# Altium project MiniPC MB GOST.PrjPcb (part 8 of 31)

## Sheet Supply Driver 12V.SchDoc
size 420 x 297 mm; Author: ALTIUM GOSTBOM2.0 KEV; SheetNumber: 43; SheetTotal: 48
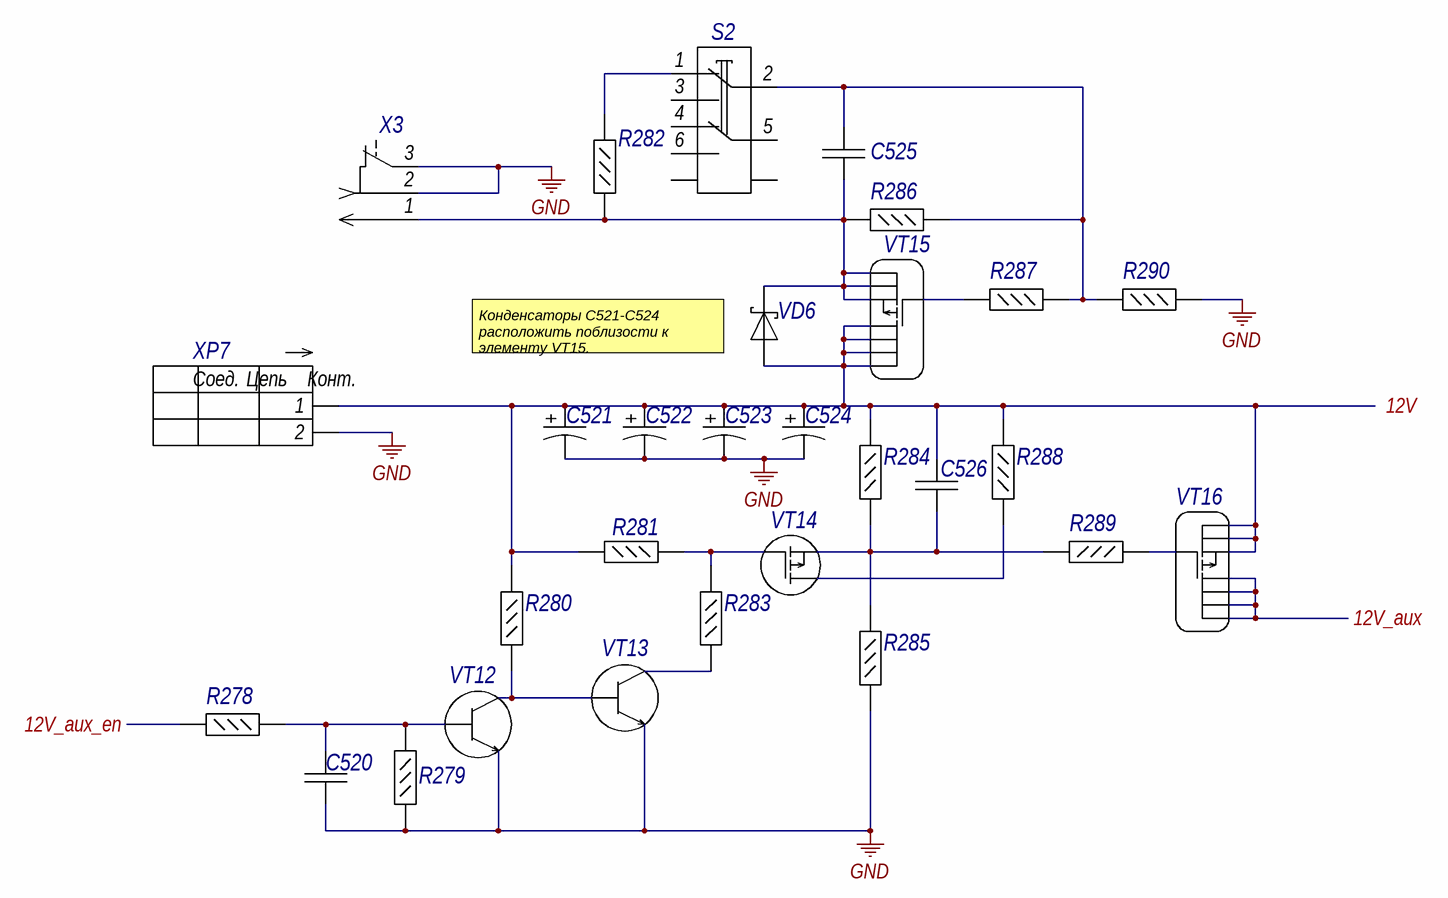
[diagram p10: Supply Driver 12V.SchDoc]

### Parts
C520  C1005X7R1E104M  [CAPC1005X55X10LL05]  (value not drawn)
C521  EEH-ZA1E331P  [PNSC-EEH-ZA1E331P_M]  (value not drawn)
C522  EEH-ZA1E331P  [PNSC-EEH-ZA1E331P_M]  (value not drawn)
C523  EEH-ZA1E331P  [PNSC-EEH-ZA1E331P_M]  (value not drawn)
C524  EEH-ZA1E331P  [PNSC-EEH-ZA1E331P_M]  (value not drawn)
C525  CGB2A1X5R1E105K033BC  [CAPC1005X33X10LL5]  (value not drawn)
C526  CGB2A1X5R1E105K033BC  [CAPC1005X33X10LL5]  (value not drawn)
R278  ERJ-2RKF1001X  [RESC1005X40X25LL05T05]  (value not drawn)
R279  ERJ-2RKF1002X  [RESC1005X40X25LL05T05]  (value not drawn)
R280  ERJ-2RKF4992X  [RESC1005X40X25LL05T05]  (value not drawn)
R281  ERJ-2RKF4992X  [RESC1005X40X25LL05T05]  (value not drawn)
R282  ERJ-2RKF10R0X  [RESC1005X40X25LL05T05]  (value not drawn)
R283  ERJ-2RKF1001X  [RESC1005X40X25LL05T05]  (value not drawn)
R284  ERJ-2RKF4992X  [RESC1005X40X25LL05T05]  (value not drawn)
R285  ERJ-2RKF1003X  [RESC1005X40X25LL05T05]  (value not drawn)
R286  ERJ-2RKF4992X  [RESC1005X40X25LL05T05]  (value not drawn)
R287  ERJ-2RKF10R0X  [RESC1005X40X25LL05T05]  (value not drawn)
R288  ERJ-2RKF10R0X  [RESC1005X40X25LL05T05]  (value not drawn)
R289  ERJ-2RKF10R0X  [RESC1005X40X25LL05T05]  (value not drawn)
R290  ERJ-2RKF1003X  [RESC1005X40X25LL05T05]  (value not drawn)
S2  EG2207  [ESWI-EG2207_V]  (value not drawn)
VD6  B530C-13-F  [DIOD-SMC-2_V]  (value not drawn)
VT12  MMBT2222A-7-F  [DIOD-SOT23-3_V]  (value not drawn)
VT13  MMBT2222A-7-F  [DIOD-SOT23-3_V]  (value not drawn)
VT14  DMP3098L-7  [DIOD-SOT23-3_V]  (value not drawn)
VT15  Si7635DP-T1-GE3  [VISH-PPAKSO-8_V]  (value not drawn)
VT16  Si7635DP-T1-GE3  [VISH-PPAKSO-8_V]  (value not drawn)
X3  16PJ032  [KOBI-16PJ032_V]  (value not drawn)
XP7  613 002 111 21  [WE-61300211121_V]  (value not drawn)

### Ports
12V, 12V_aux, 12V_aux_en

### Nets
GND: C520.1 C521.2 C522.2 C523.2 C524.2 R279.1 R285.1 R290.1 VT12.2 VT13.2 X3.2 X3.3 XP7.2
12V_INPUT: C521.1 C522.1 C523.1 C524.1 C526.2 R280.2 R281.2 R284.2 R288.2 VD6.1(A) VT15.5(D) VT15.6(D) VT15.7(D) VT15.8(D) VT16.1(S) VT16.2(S) VT16.3(S) XP7.1 ; port 12V
aux_12V: VT16.5(D) VT16.6(D) VT16.7(D) VT16.8(D) ; port 12V_aux
NetC520_2: C520.2 R278.2 R279.2 VT12.1
NetC525_1: C525.1 R286.1 R287.1 R290.2 S2.2
NetC525_2: C525.2 R282.2 R286.2 VD6.2(K) VT15.1(S) VT15.2(S) VT15.3(S) X3.1
NetC526_1: C526.1 R284.1 R285.2 R289.1 VT14.2
NetR278_1: R278.1 ; port 12V_aux_en
NetR280_1: R280.1 VT12.3 VT13.1
NetR281_1: R281.1 R283.2 VT14.1
NetR282_1: R282.1 S2.1
NetR283_1: R283.1 VT13.3
NetR287_2: R287.2 VT15.4(G)
NetR288_1: R288.1 VT14.3
NetR289_2: R289.2 VT16.4(G)

Not connected (* = marked no-connect by the designer): S2 3 4 5 6 MH1 MH2

### Notes on the sheet
- (near VD6) Конденсаторы C521-C524 расположить поблизости к элементу VT15.
- Подп. дата
- Инв. № дубл.
- Взам. инв. №
- Подп. и дата
- Инв. № подл.
- Изм.
- Лист
- № докум.
- Подп.
- Дата
- ALTIUM GOSTBOM2.0 KEV
- Файл:
- Копировал
- Формат А3
- (in symbol E12) +
- (in symbol E32) Соед.; Цепь; Конт.

### Library data of the parts
C520 = E11: Chip Capacitor, 0.1 uF, +/- 20%, 25 V, -55 to 125 degC, 0402 (1005 Metric), RoHS, Tape and Reel; Тип элемента: Конденсатор; Capacitance: 100 nF; Case\/Package: 0402; Type (Capacitors): X7R; Voltage Rating: 25 V; Old_des: C79; New_des: C520; UID: E11; Component Kind: Standard; Case Code (Imperial): 0402; Case Code (Metric): 1005; ComponentLink1Description: Manufacturer URL; ComponentLink1URL: http://www.tdk.com/; ComponentLink2Description: Datasheet; ComponentLink2URL: http://www.farnell.com/datasheets/1571323.pdf; DatasheetVersion: 09/2011; Length: 1 mm; Max Operating Temperature: 125 degC; Min Operating Temperature: -55 degC; Mounting Technology: Surface Mount; Package Quantity: 10000; PackageDescription: 2-Pin Surface Mount Device, Body 1 x 0.5 mm; Packaging: Tape and Reel; PartNumber: C1005X7R1E104M; RoHSCompliant: true; Tolerance: 20%; Width: 0.5 mm; Height: 0.5 mm; Mount: Surface Mount; PackageReference: 0402; Pins: 2; Voltage Rating (DC): 25 V
C521 = E12: Aluminum Electrolytic Capacitor, 330 uF, +/- 20%, 25 V, -55 to 105 degC, 2-Pin CAPAE, RoHS, Tape and Reel; Тип элемента: Конденсатор; Capacitance: 330 uF; Case\/Package: G; Voltage Rating: 25 V; Old_des: C74; New_des: C521; UID: E12; Component Kind: Standard; ComponentLink1Description: Manufacturer URL; ComponentLink1URL: http://www.panasonic.com/; ComponentLink2Description: Datasheet; ComponentLink2URL: https://datasheet.ciiva.com/25613/0900766b81233638-25613835.pdf; DatasheetVersion: 10/2014; Length: 10.2 mm; Max Operating Temperature: 105 degC; Min Operating Temperature: -55 degC; Mounting Technology: Surface Mount; Package Quantity: 500; PackageDescription: 2-Pin Aluminum Electrolytic Capacitor, Body 10.2 x 10.2 mm, Diameter 10 mm; Packaging: Tape and Reel; RoHSCompliant: true; Tolerance: 20%; Height: 10.5 mm; Mount: Surface Mount; PackageReference: EEH-ZA1E331P; Radiation Hardening: No; REACH SVHC: Unknown; Voltage Rating (DC): 25 V
C522 = E12: Aluminum Electrolytic Capacitor, 330 uF, +/- 20%, 25 V, -55 to 105 degC, 2-Pin CAPAE, RoHS, Tape and Reel; Тип элемента: Конденсатор; Capacitance: 330 uF; Case\/Package: G; Voltage Rating: 25 V; Old_des: C75; New_des: C522; UID: E12; Component Kind: Standard; ComponentLink1Description: Manufacturer URL; ComponentLink1URL: http://www.panasonic.com/; ComponentLink2Description: Datasheet; ComponentLink2URL: https://datasheet.ciiva.com/25613/0900766b81233638-25613835.pdf; DatasheetVersion: 10/2014; Length: 10.2 mm; Max Operating Temperature: 105 degC; Min Operating Temperature: -55 degC; Mounting Technology: Surface Mount; Package Quantity: 500; PackageDescription: 2-Pin Aluminum Electrolytic Capacitor, Body 10.2 x 10.2 mm, Diameter 10 mm; Packaging: Tape and Reel; RoHSCompliant: true; Tolerance: 20%; Height: 10.5 mm; Mount: Surface Mount; PackageReference: EEH-ZA1E331P; Radiation Hardening: No; REACH SVHC: Unknown; Voltage Rating (DC): 25 V
C523 = E12: Aluminum Electrolytic Capacitor, 330 uF, +/- 20%, 25 V, -55 to 105 degC, 2-Pin CAPAE, RoHS, Tape and Reel; Тип элемента: Конденсатор; Capacitance: 330 uF; Case\/Package: G; Voltage Rating: 25 V; Old_des: C76; New_des: C523; UID: E12; Component Kind: Standard; ComponentLink1Description: Manufacturer URL; ComponentLink1URL: http://www.panasonic.com/; ComponentLink2Description: Datasheet; ComponentLink2URL: https://datasheet.ciiva.com/25613/0900766b81233638-25613835.pdf; DatasheetVersion: 10/2014; Length: 10.2 mm; Max Operating Temperature: 105 degC; Min Operating Temperature: -55 degC; Mounting Technology: Surface Mount; Package Quantity: 500; PackageDescription: 2-Pin Aluminum Electrolytic Capacitor, Body 10.2 x 10.2 mm, Diameter 10 mm; Packaging: Tape and Reel; RoHSCompliant: true; Tolerance: 20%; Height: 10.5 mm; Mount: Surface Mount; PackageReference: EEH-ZA1E331P; Radiation Hardening: No; REACH SVHC: Unknown; Voltage Rating (DC): 25 V
C524 = E12: Aluminum Electrolytic Capacitor, 330 uF, +/- 20%, 25 V, -55 to 105 degC, 2-Pin CAPAE, RoHS, Tape and Reel; Тип элемента: Конденсатор; Capacitance: 330 uF; Case\/Package: G; Voltage Rating: 25 V; Old_des: C77; New_des: C524; UID: E12; Component Kind: Standard; ComponentLink1Description: Manufacturer URL; ComponentLink1URL: http://www.panasonic.com/; ComponentLink2Description: Datasheet; ComponentLink2URL: https://datasheet.ciiva.com/25613/0900766b81233638-25613835.pdf; DatasheetVersion: 10/2014; Length: 10.2 mm; Max Operating Temperature: 105 degC; Min Operating Temperature: -55 degC; Mounting Technology: Surface Mount; Package Quantity: 500; PackageDescription: 2-Pin Aluminum Electrolytic Capacitor, Body 10.2 x 10.2 mm, Diameter 10 mm; Packaging: Tape and Reel; RoHSCompliant: true; Tolerance: 20%; Height: 10.5 mm; Mount: Surface Mount; PackageReference: EEH-ZA1E331P; Radiation Hardening: No; REACH SVHC: Unknown; Voltage Rating (DC): 25 V
C525 = E2: Chip Capacitor, 1 uF, +/- 10%, 25 V, -55 to 85 degC, 0402 (1005 Metric), RoHS, Tape and Reel; Тип элемента: Конденсатор; Capacitance: 1 uF; Old_des: C73; New_des: C525; UID: E2; Component Kind: Standard; Case Code (Imperial): 0402; Case Code (Metric): 1005; Case/Package: 0402; ComponentLink1Description: Manufacturer URL; ComponentLink1URL: http://www.tdk.com/; ComponentLink2Description: Datasheet; ComponentLink2URL: https://product.tdk.com/info/en/catalog/datasheets/mlcc_commercial_lowprofile_en.pdf; DatasheetVersion: 04/2015; Length: 0.039 inch; Max Operating Temperature: 85 degC; Min Operating Temperature: -55 degC; Mounting Technology: Surface Mount; Package Quantity: 1; PackageDescription: 2-Pin Surface Mount Device, Body 1 x 0.5 mm; Packaging: Tape and Reel; PartNumber: CGB2A1X5R1E105K033BC; RoHSCompliant: True; Tolerance: 10%; Width: 0.02 inch
C526 = E2: Chip Capacitor, 1 uF, +/- 10%, 25 V, -55 to 85 degC, 0402 (1005 Metric), RoHS, Tape and Reel; Тип элемента: Конденсатор; Capacitance: 1 uF; Old_des: C78; New_des: C526; UID: E2; Component Kind: Standard; Case Code (Imperial): 0402; Case Code (Metric): 1005; Case/Package: 0402; ComponentLink1Description: Manufacturer URL; ComponentLink1URL: http://www.tdk.com/; ComponentLink2Description: Datasheet; ComponentLink2URL: https://product.tdk.com/info/en/catalog/datasheets/mlcc_commercial_lowprofile_en.pdf; DatasheetVersion: 04/2015; Length: 0.039 inch; Max Operating Temperature: 85 degC; Min Operating Temperature: -55 degC; Mounting Technology: Surface Mount; Package Quantity: 1; PackageDescription: 2-Pin Surface Mount Device, Body 1 x 0.5 mm; Packaging: Tape and Reel; PartNumber: CGB2A1X5R1E105K033BC; RoHSCompliant: True; Tolerance: 10%; Width: 0.02 inch
R278 = E59: Chip Resistor, 1 KOhm, +/- 1%, 100 mW, -55 to 155 degC, 0402 (1005 Metric), RoHS, Tape and Reel; Manufacturer: Basic Passives; Тип элемента: Резистор; Case\/Package: 0402; Voltage Rating: 50 V; Power Rating: 100 mW; Resistance: 1 KOhm; Old_des: R139; New_des: R278; UID: E59; Component Kind: Standard; Case Code (Imperial): 0402; Case Code (Metric): 1005; ComponentLink1Description: Manufacturer URL; ComponentLink1URL: http://www.panasonic.com/; ComponentLink2Description: Datasheet; ComponentLink2URL: http://industrial.panasonic.com/cdbs/www-data/pdf/RDA0000/AOA0000C86.pdf; DatasheetVersion: 04/2015; Length: 1 mm; Max Operating Temperature: 155 degC; Min Operating Temperature: -55 degC; Mounting Technology: Surface Mount; Package Quantity: 10000; PackageDescription: 2-Pin Surface Mount Device, Body 1 x 0.5 mm; Packaging: Tape and Reel; PartNumber: ERJ-2RKF1001X; RoHSCompliant: true; Tolerance: 1%; Width: 0.5 mm; Height: 0.35 mm; Mount: Surface Mount; PackageReference: 0402; Pins: 2; Radiation Hardening: No; REACH SVHC: Yes
R279 = E60: Chip Resistor, 10 KOhm, +/- 1%, 100 mW, -55 to 155 degC, 0402 (1005 Metric), RoHS, Tape and Reel; Manufacturer: Basic Passives; Тип элемента: Резистор; Case\/Package: 0402; Voltage Rating: 50 V; Power Rating: 100 mW; Resistance: 10 KOhm; Old_des: R140; New_des: R279; UID: E60; Component Kind: Standard; Case Code (Imperial): 0402; Case Code (Metric): 1005; ComponentLink1Description: Manufacturer URL; ComponentLink1URL: http://www.panasonic.com/; ComponentLink2Description: Datasheet; ComponentLink2URL: http://industrial.panasonic.com/cdbs/www-data/pdf/RDA0000/AOA0000C86.pdf; DatasheetVersion: 04/2015; Length: 1 mm; Max Operating Temperature: 155 degC; Min Operating Temperature: -55 degC; Mounting Technology: Surface Mount; Package Quantity: 10000; PackageDescription: 2-Pin Surface Mount Device, Body 1 x 0.5 mm; Packaging: Tape and Reel; PartNumber: ERJ-2RKF1002X; RoHSCompliant: true; Tolerance: 1%; Width: 0.5 mm; Height: 0.35 mm; Mount: Surface Mount; PackageReference: 0402; Pins: 2; Radiation Hardening: No; REACH SVHC: Yes
R280 = E57: Chip Resistor, 49.9 KOhm, +/- 1%, 100 mW, -55 to 155 degC, 0402 (1005 Metric), RoHS, Tape and Reel; Manufacturer: Basic Passives; Тип элемента: Резистор; Case\/Package: 0402; Voltage Rating: 50 V; Power Rating: 100 mW; Old_des: R133; New_des: R280; UID: E57; Component Kind: Standard; Case Code (Imperial): 0402; Case Code (Metric): 1005; ComponentLink1Description: Manufacturer URL; ComponentLink1URL: http://www.panasonic.com/; ComponentLink2Description: Datasheet; ComponentLink2URL: http://industrial.panasonic.com/cdbs/www-data/pdf/RDA0000/AOA0000C86.pdf; DatasheetVersion: 04/2015; Length: 1 mm; Max Operating Temperature: 155 degC; Min Operating Temperature: -55 degC; Mounting Technology: Surface Mount; Package Quantity: 10000; PackageDescription: 2-Pin Surface Mount Device, Body 1 x 0.5 mm; Packaging: Tape and Reel; PartNumber: ERJ-2RKF4992X; RoHSCompliant: true; Tolerance: 1%; Width: 0.5 mm; Height: 0.35 mm; Mount: Surface Mount; PackageReference: 0402; Pins: 2; Radiation Hardening: No; REACH SVHC: No SVHC; Resistance: 49.9 KOhm
R281 = E57: Chip Resistor, 49.9 KOhm, +/- 1%, 100 mW, -55 to 155 degC, 0402 (1005 Metric), RoHS, Tape and Reel; Manufacturer: Basic Passives; Тип элемента: Резистор; Case\/Package: 0402; Voltage Rating: 50 V; Power Rating: 100 mW; Old_des: R134; New_des: R281; UID: E57; Component Kind: Standard; Case Code (Imperial): 0402; Case Code (Metric): 1005; ComponentLink1Description: Manufacturer URL; ComponentLink1URL: http://www.panasonic.com/; ComponentLink2Description: Datasheet; ComponentLink2URL: http://industrial.panasonic.com/cdbs/www-data/pdf/RDA0000/AOA0000C86.pdf; DatasheetVersion: 04/2015; Length: 1 mm; Max Operating Temperature: 155 degC; Min Operating Temperature: -55 degC; Mounting Technology: Surface Mount; Package Quantity: 10000; PackageDescription: 2-Pin Surface Mount Device, Body 1 x 0.5 mm; Packaging: Tape and Reel; PartNumber: ERJ-2RKF4992X; RoHSCompliant: true; Tolerance: 1%; Width: 0.5 mm; Height: 0.35 mm; Mount: Surface Mount; PackageReference: 0402; Pins: 2; Radiation Hardening: No; REACH SVHC: No SVHC; Resistance: 49.9 KOhm
R282 = E56: Chip Resistor, 10 Ohm, +/- 1%, 100 mW, -55 to 155 degC, 0402 (1005 Metric), RoHS, Tape and Reel; Manufacturer: Basic Passives; Тип элемента: Резистор; Case\/Package: 0402; Voltage Rating: 50 V; Power Rating: 100 mW; Resistance: 10 Ohm; Old_des: R128; New_des: R282; UID: E56; Component Kind: Standard; Case Code (Imperial): 0402; Case Code (Metric): 1005; ComponentLink1Description: Manufacturer URL; ComponentLink1URL: http://www.panasonic.com/; ComponentLink2Description: Datasheet; ComponentLink2URL: http://industrial.panasonic.com/cdbs/www-data/pdf/RDA0000/AOA0000C86.pdf; DatasheetVersion: 04/2015; Length: 1 mm; Max Operating Temperature: 155 degC; Min Operating Temperature: -55 degC; Mounting Technology: Surface Mount; Package Quantity: 10000; PackageDescription: 2-Pin Surface Mount Device, Body 1 x 0.5 mm; Packaging: Tape and Reel; PartNumber: ERJ-2RKF10R0X; RoHSCompliant: true; Tolerance: 1%; Width: 0.5 mm; Height: 0.35 mm; Mount: Surface Mount; PackageReference: 0402; Pins: 2; Radiation Hardening: No; REACH SVHC: Yes
R283 = E59: Chip Resistor, 1 KOhm, +/- 1%, 100 mW, -55 to 155 degC, 0402 (1005 Metric), RoHS, Tape and Reel; Manufacturer: Basic Passives; Тип элемента: Резистор; Case\/Package: 0402; Voltage Rating: 50 V; Power Rating: 100 mW; Resistance: 1 KOhm; Old_des: R138; New_des: R283; UID: E59; Component Kind: Standard; Case Code (Imperial): 0402; Case Code (Metric): 1005; ComponentLink1Description: Manufacturer URL; ComponentLink1URL: http://www.panasonic.com/; ComponentLink2Description: Datasheet; ComponentLink2URL: http://industrial.panasonic.com/cdbs/www-data/pdf/RDA0000/AOA0000C86.pdf; DatasheetVersion: 04/2015; Length: 1 mm; Max Operating Temperature: 155 degC; Min Operating Temperature: -55 degC; Mounting Technology: Surface Mount; Package Quantity: 10000; PackageDescription: 2-Pin Surface Mount Device, Body 1 x 0.5 mm; Packaging: Tape and Reel; PartNumber: ERJ-2RKF1001X; RoHSCompliant: true; Tolerance: 1%; Width: 0.5 mm; Height: 0.35 mm; Mount: Surface Mount; PackageReference: 0402; Pins: 2; Radiation Hardening: No; REACH SVHC: Yes
R284 = E57: Chip Resistor, 49.9 KOhm, +/- 1%, 100 mW, -55 to 155 degC, 0402 (1005 Metric), RoHS, Tape and Reel; Manufacturer: Basic Passives; Тип элемента: Резистор; Case\/Package: 0402; Voltage Rating: 50 V; Power Rating: 100 mW; Old_des: R132; New_des: R284; UID: E57; Component Kind: Standard; Case Code (Imperial): 0402; Case Code (Metric): 1005; ComponentLink1Description: Manufacturer URL; ComponentLink1URL: http://www.panasonic.com/; ComponentLink2Description: Datasheet; ComponentLink2URL: http://industrial.panasonic.com/cdbs/www-data/pdf/RDA0000/AOA0000C86.pdf; DatasheetVersion: 04/2015; Length: 1 mm; Max Operating Temperature: 155 degC; Min Operating Temperature: -55 degC; Mounting Technology: Surface Mount; Package Quantity: 10000; PackageDescription: 2-Pin Surface Mount Device, Body 1 x 0.5 mm; Packaging: Tape and Reel; PartNumber: ERJ-2RKF4992X; RoHSCompliant: true; Tolerance: 1%; Width: 0.5 mm; Height: 0.35 mm; Mount: Surface Mount; PackageReference: 0402; Pins: 2; Radiation Hardening: No; REACH SVHC: No SVHC; Resistance: 49.9 KOhm
R285 = E58: Chip Resistor, 100 KOhm, +/- 1%, 100 mW, -55 to 155 degC, 0402 (1005 Metric), RoHS, Tape and Reel; Manufacturer: Basic Passives; Тип элемента: Резистор; Case\/Package: 0402; Voltage Rating: 50 V; Power Rating: 100 mW; Old_des: R137; New_des: R285; UID: E58; Component Kind: Standard; Case Code (Imperial): 0402; Case Code (Metric): 1005; ComponentLink1Description: Manufacturer URL; ComponentLink1URL: http://www.panasonic.com/; ComponentLink2Description: Datasheet; ComponentLink2URL: http://industrial.panasonic.com/cdbs/www-data/pdf/RDA0000/AOA0000C86.pdf; DatasheetVersion: 04/2015; Length: 1 mm; Max Operating Temperature: 155 degC; Min Operating Temperature: -55 degC; Mounting Technology: Surface Mount; Package Quantity: 10000; PackageDescription: 2-Pin Surface Mount Device, Body 1 x 0.5 mm; Packaging: Tape and Reel; PartNumber: ERJ-2RKF1003X; RoHSCompliant: true; Tolerance: 1%; Width: 0.5 mm; Height: 0.35 mm; Mount: Surface Mount; PackageReference: 0402; Pins: 2; Radiation Hardening: No; REACH SVHC: Yes; Resistance: 100 KOhm
R286 = E57: Chip Resistor, 49.9 KOhm, +/- 1%, 100 mW, -55 to 155 degC, 0402 (1005 Metric), RoHS, Tape and Reel; Manufacturer: Basic Passives; Тип элемента: Резистор; Case\/Package: 0402; Voltage Rating: 50 V; Power Rating: 100 mW; Old_des: R129; New_des: R286; UID: E57; Component Kind: Standard; Case Code (Imperial): 0402; Case Code (Metric): 1005; ComponentLink1Description: Manufacturer URL; ComponentLink1URL: http://www.panasonic.com/; ComponentLink2Description: Datasheet; ComponentLink2URL: http://industrial.panasonic.com/cdbs/www-data/pdf/RDA0000/AOA0000C86.pdf; DatasheetVersion: 04/2015; Length: 1 mm; Max Operating Temperature: 155 degC; Min Operating Temperature: -55 degC; Mounting Technology: Surface Mount; Package Quantity: 10000; PackageDescription: 2-Pin Surface Mount Device, Body 1 x 0.5 mm; Packaging: Tape and Reel; PartNumber: ERJ-2RKF4992X; RoHSCompliant: true; Tolerance: 1%; Width: 0.5 mm; Height: 0.35 mm; Mount: Surface Mount; PackageReference: 0402; Pins: 2; Radiation Hardening: No; REACH SVHC: No SVHC; Resistance: 49.9 KOhm
R287 = E56: Chip Resistor, 10 Ohm, +/- 1%, 100 mW, -55 to 155 degC, 0402 (1005 Metric), RoHS, Tape and Reel; Manufacturer: Basic Passives; Тип элемента: Резистор; Case\/Package: 0402; Voltage Rating: 50 V; Power Rating: 100 mW; Resistance: 10 Ohm; Old_des: R130; New_des: R287; UID: E56; Component Kind: Standard; Case Code (Imperial): 0402; Case Code (Metric): 1005; ComponentLink1Description: Manufacturer URL; ComponentLink1URL: http://www.panasonic.com/; ComponentLink2Description: Datasheet; ComponentLink2URL: http://industrial.panasonic.com/cdbs/www-data/pdf/RDA0000/AOA0000C86.pdf; DatasheetVersion: 04/2015; Length: 1 mm; Max Operating Temperature: 155 degC; Min Operating Temperature: -55 degC; Mounting Technology: Surface Mount; Package Quantity: 10000; PackageDescription: 2-Pin Surface Mount Device, Body 1 x 0.5 mm; Packaging: Tape and Reel; PartNumber: ERJ-2RKF10R0X; RoHSCompliant: true; Tolerance: 1%; Width: 0.5 mm; Height: 0.35 mm; Mount: Surface Mount; PackageReference: 0402; Pins: 2; Radiation Hardening: No; REACH SVHC: Yes
R288 = E56: Chip Resistor, 10 Ohm, +/- 1%, 100 mW, -55 to 155 degC, 0402 (1005 Metric), RoHS, Tape and Reel; Manufacturer: Basic Passives; Тип элемента: Резистор; Case\/Package: 0402; Voltage Rating: 50 V; Power Rating: 100 mW; Resistance: 10 Ohm; Old_des: R135; New_des: R288; UID: E56; Component Kind: Standard; Case Code (Imperial): 0402; Case Code (Metric): 1005; ComponentLink1Description: Manufacturer URL; ComponentLink1URL: http://www.panasonic.com/; ComponentLink2Description: Datasheet; ComponentLink2URL: http://industrial.panasonic.com/cdbs/www-data/pdf/RDA0000/AOA0000C86.pdf; DatasheetVersion: 04/2015; Length: 1 mm; Max Operating Temperature: 155 degC; Min Operating Temperature: -55 degC; Mounting Technology: Surface Mount; Package Quantity: 10000; PackageDescription: 2-Pin Surface Mount Device, Body 1 x 0.5 mm; Packaging: Tape and Reel; PartNumber: ERJ-2RKF10R0X; RoHSCompliant: true; Tolerance: 1%; Width: 0.5 mm; Height: 0.35 mm; Mount: Surface Mount; PackageReference: 0402; Pins: 2; Radiation Hardening: No; REACH SVHC: Yes
R289 = E56: Chip Resistor, 10 Ohm, +/- 1%, 100 mW, -55 to 155 degC, 0402 (1005 Metric), RoHS, Tape and Reel; Manufacturer: Basic Passives; Тип элемента: Резистор; Case\/Package: 0402; Voltage Rating: 50 V; Power Rating: 100 mW; Resistance: 10 Ohm; Old_des: R136; New_des: R289; UID: E56; Component Kind: Standard; Case Code (Imperial): 0402; Case Code (Metric): 1005; ComponentLink1Description: Manufacturer URL; ComponentLink1URL: http://www.panasonic.com/; ComponentLink2Description: Datasheet; ComponentLink2URL: http://industrial.panasonic.com/cdbs/www-data/pdf/RDA0000/AOA0000C86.pdf; DatasheetVersion: 04/2015; Length: 1 mm; Max Operating Temperature: 155 degC; Min Operating Temperature: -55 degC; Mounting Technology: Surface Mount; Package Quantity: 10000; PackageDescription: 2-Pin Surface Mount Device, Body 1 x 0.5 mm; Packaging: Tape and Reel; PartNumber: ERJ-2RKF10R0X; RoHSCompliant: true; Tolerance: 1%; Width: 0.5 mm; Height: 0.35 mm; Mount: Surface Mount; PackageReference: 0402; Pins: 2; Radiation Hardening: No; REACH SVHC: Yes
R290 = E58: Chip Resistor, 100 KOhm, +/- 1%, 100 mW, -55 to 155 degC, 0402 (1005 Metric), RoHS, Tape and Reel; Manufacturer: Basic Passives; Тип элемента: Резистор; Case\/Package: 0402; Voltage Rating: 50 V; Power Rating: 100 mW; Old_des: R131; New_des: R290; UID: E58; Component Kind: Standard; Case Code (Imperial): 0402; Case Code (Metric): 1005; ComponentLink1Description: Manufacturer URL; ComponentLink1URL: http://www.panasonic.com/; ComponentLink2Description: Datasheet; ComponentLink2URL: http://industrial.panasonic.com/cdbs/www-data/pdf/RDA0000/AOA0000C86.pdf; DatasheetVersion: 04/2015; Length: 1 mm; Max Operating Temperature: 155 degC; Min Operating Temperature: -55 degC; Mounting Technology: Surface Mount; Package Quantity: 10000; PackageDescription: 2-Pin Surface Mount Device, Body 1 x 0.5 mm; Packaging: Tape and Reel; PartNumber: ERJ-2RKF1003X; RoHSCompliant: true; Tolerance: 1%; Width: 0.5 mm; Height: 0.35 mm; Mount: Surface Mount; PackageReference: 0402; Pins: 2; Radiation Hardening: No; REACH SVHC: Yes; Resistance: 100 KOhm
S2 = E103: Slide Switch DPDT, 30 V, -20 to 70 degC, 6-Pin THD, RoHS, Bulk; Тип элемента: Набор 2 ключа; Old_des: SW1; New_des: S2; UID: E103; Component Kind: Standard; ComponentLink1Description: Manufacturer URL; ComponentLink1URL: http://www.e-switch.ch/en/; ComponentLink2Description: Datasheet; ComponentLink2URL: https://datasheet.ciiva.com/16174/p040100-16174286.pdf; DatasheetVersion: Rev. E; Length: 10 mm; Max Operating Temperature: 70 degC; Min Operating Temperature: -20 degC; Mounting Technology: Through Hole; Package Quantity: 1000; PackageDescription: 6-Pin Throung Hole Device, Body 10 x 6 mm, Pitch 2 mm; Packaging: Bulk; PartNumber: EG2207; RoHSCompliant: True; Width: 6 mm; Height: 7.7 mm; Mount: Through Hole; REACH SVHC: No SVHC
VD6 = E28: Surface Mount Schottky Barrier Rectifier, 5 A, 0.55 V, -55 to 150 degC, 2-Pin SMD, RoHS, Tape and Reel; Manufacturer: Diodes Inc; Тип элемента: Диод Шоттки; Old_des: D1; New_des: VD6; UID: E28; Component Kind: Standard; ComponentLink1Description: Manufacturer URL; ComponentLink1URL: http://www.diodes.com/; ComponentLink2Description: Datasheet; ComponentLink2URL: http://www.diodes.com/_files/datasheets/ds13012.pdf; DatasheetVersion: Rev. 16-2; Mounting Technology: Surface Mount; PackageDescription: 2-Pin Surface Mount Device, Body 5.905 x 6.855 mm; PartNumber: B530C-13-F; PackageReference: SMC-2
VT12 = E53: NPN Small Signal Transistor, 40 V, -55 to 150 degC, 3-Pin SOT23, RoHS, Tape and Reel; Manufacturer: Diodes Inc; Тип элемента: NPN-транзистор; Old_des: Q24; New_des: VT12; UID: E53; Component Kind: Standard; ComponentLink1Description: Manufacturer URL; ComponentLink1URL: http://www.diodes.com/; ComponentLink2Description: Datasheet; ComponentLink2URL: http://www.diodes.com/_files/datasheets/ds30041.pdf; DatasheetVersion: Rev. 16 - 2; Mounting Technology: Surface Mount; PackageDescription: 3-Pin Small Outline Transistor, Body 2.9 x 1.3 mm, Pitch 0.95 mm; PartNumber: MMBT2222A-7-F; PackageReference: SOT23-3
VT13 = E53: NPN Small Signal Transistor, 40 V, -55 to 150 degC, 3-Pin SOT23, RoHS, Tape and Reel; Manufacturer: Diodes Inc; Тип элемента: NPN-транзистор; Old_des: Q23; New_des: VT13; UID: E53; Component Kind: Standard; ComponentLink1Description: Manufacturer URL; ComponentLink1URL: http://www.diodes.com/; ComponentLink2Description: Datasheet; ComponentLink2URL: http://www.diodes.com/_files/datasheets/ds30041.pdf; DatasheetVersion: Rev. 16 - 2; Mounting Technology: Surface Mount; PackageDescription: 3-Pin Small Outline Transistor, Body 2.9 x 1.3 mm, Pitch 0.95 mm; PartNumber: MMBT2222A-7-F; PackageReference: SOT23-3
VT14 = E55: P-Channel Enhancement Mode MOSFET, -30 V VDS, -55 to 155 degC, 3-Pin SOT23, RoHS, Tape and Reel; Manufacturer: Diodes Inc; Тип элемента: МДП-транзистор, индуцированный P канал; IDS (TA: 25 degC)=-3.8 A; PD (TA: 25 degC)=1.08 W; RDS(on) (Max#) (VGS: 4.5 V)=120 mOhm; VDS: -30 V; VGS: +/- 20 V; VGS(th) (Max#): -2.1 V; Old_des: Q22; New_des: VT14; UID: E55; Component Kind: Standard; ComponentLink1Description: Manufacturer URL; ComponentLink1URL: http://www.diodes.com/; ComponentLink2Description: Datasheet; ComponentLink2URL: http://www.diodes.com/datasheets/ds31447.pdf; DatasheetVersion: Rev. 8 - 2; Mounting Technology: Surface Mount; PackageDescription: 3-Pin Small Outline Transistor, Body 1.3 x 2.9 mm, Pitch 0.95 mm; PartNumber: DMP3098L-7; PackageReference: SOT23; ComponentLink3Description: Package Specification; ComponentLink3URL: http://www.diodes.com/datasheets/ap02002.pdf; PackageVersion: Rev. 75; Operating Temperature Range: -55 to 150 degC; Packing: Tape and Reel; RoHS: TRUE
VT15 = E54: P-Channel MOSFET, 20 V, -55 to 150 degC, 8-Pin SMD (PPAKSO-8), RoHS, Tape and Reel; Тип элемента: МДП-транзистор, индуцированный P канал; Old_des: Q20; New_des: VT15; UID: E54; Component Kind: Standard; ComponentLink1Description: Manufacturer URL; ComponentLink1URL: http://www.vishay.com/; ComponentLink2Description: Datasheet; ComponentLink2URL: http://www.vishay.com/docs/65021/si7635dp.pdf; DatasheetVersion: Rev. B; Mounting Technology: Surface Mount; PackageDescription: 8-Pin Surface Mount Device, Body 4.9 x 5.89 mm, Pitch 1.27 mm; PartNumber: Si7635DP-T1-GE3
VT16 = E54: P-Channel MOSFET, 20 V, -55 to 150 degC, 8-Pin SMD (PPAKSO-8), RoHS, Tape and Reel; Тип элемента: МДП-транзистор, индуцированный P канал; Old_des: Q21; New_des: VT16; UID: E54; Component Kind: Standard; ComponentLink1Description: Manufacturer URL; ComponentLink1URL: http://www.vishay.com/; ComponentLink2Description: Datasheet; ComponentLink2URL: http://www.vishay.com/docs/65021/si7635dp.pdf; DatasheetVersion: Rev. B; Mounting Technology: Surface Mount; PackageDescription: 8-Pin Surface Mount Device, Body 4.9 x 5.89 mm, Pitch 1.27 mm; PartNumber: Si7635DP-T1-GE3
X3 = E33: DC Power Jack, Female, -10 to 70 degC, 3-Pin THD, RoHS; Тип элемента: Соединитель; Voltage Rating: 16 V; Current Rating: 1 A; Old_des: J4; New_des: X3; UID: E33; Component Kind: Standard; ComponentLink1Description: Manufacturer URL; ComponentLink1URL: http://kobiconn.industrialpartner.com/; ComponentLink2Description: Datasheet; ComponentLink2URL: https://datasheet.ciiva.com/12342/kc-300037-195479-12342832.pdf; DatasheetVersion: 05/2009; Max Operating Temperature: 70 degC; Min Operating Temperature: -10 degC; Mounting Technology: Through Hole; Package Quantity: 100; PackageDescription: 3-Pin Through Hole Device, Body 8.9916 x 13.4874 mm; PartNumber: 16PJ032; RoHSCompliant: false; Connector Type: Power; Gender: Female
XP7 = E32: Male Header, Pitch 2.54 mm, 1 x 2 Position, Height 8.54 mm, Tail Length 3 mm, -40 to 105 degC, RoHS, Bulk; Manufacturer: Wuerth Elektronik; Тип элемента: Соединитель; Old_des: J5; New_des: XP7; UID: E32; Component Kind: Standard; ComponentLink1Description: Manufacturer URL; ComponentLink1URL: https://www.we-online.com/; ComponentLink2Description: Datasheet; ComponentLink2URL: http://katalog.we-online.de/em/datasheet/6130xx11121.pdf; DatasheetVersion: Rev. J; Mounting Technology: Through Hole; PackageDescription: Male Header, Pitch 2.54 mm, 1 x 2 Position, Height 8.54 mm, Tail Length 3 mm; PartNumber: 613 002 111 21; PackageReference: 61300211121